# Altium schematic sheet ArcadeMVD-STM 01-1.5 complete design.SchDoc: complete design
size A3; DocumentNumber: 1; SheetNumber: 1; SheetTotal: 2; VersionControl_RevNumber: 1
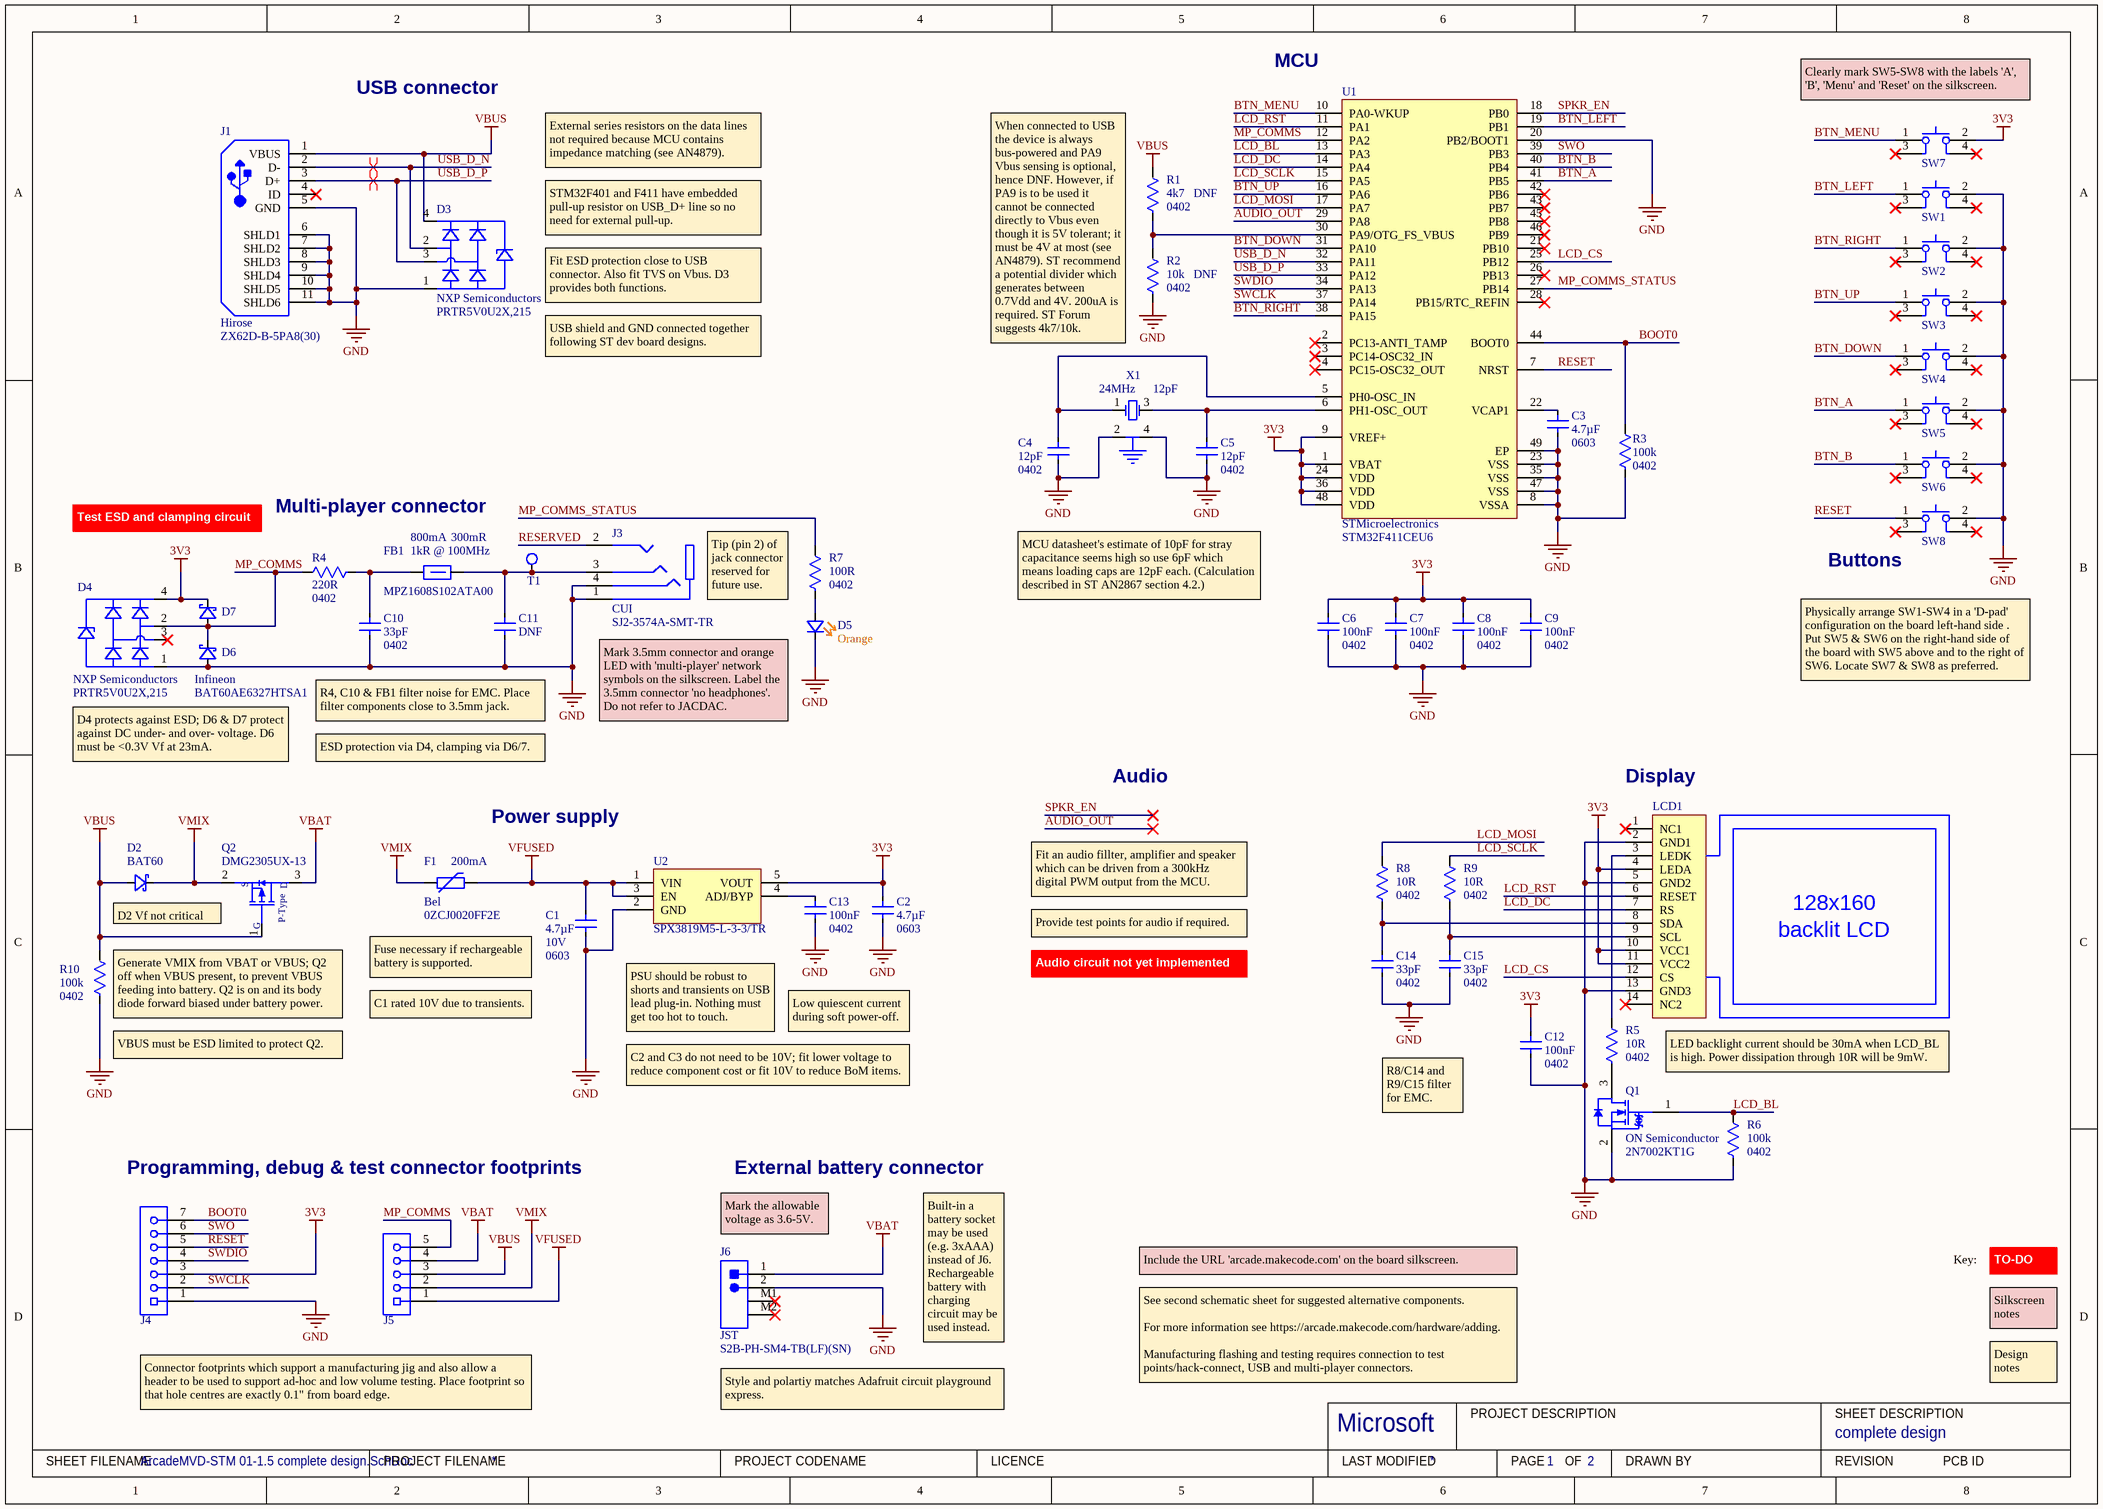
[diagram p0: ArcadeMVD-STM 01-1.5 complete design.SchDoc]

## Parts
C1  Case/Package: 0603  Capacitance: 4.7µF  Voltage Rating: 10V  [CAP 0603 (1608) x 1.2mm]  (hidden comment: CL10A475KP8NNNC)
C2  Case/Package: 0603  Capacitance: 4.7µF  [CAP 0603 (1608) x 1.2mm]  (hidden comment: CL10A475KP8NNNC)
C3  Case/Package: 0603  Capacitance: 4.7µF  [CAP 0603 (1608) x 1.2mm]  (hidden comment: CL10A475KP8NNNC)
C4  value 12pF  Package Size: 0402  [CAP0402]  (hidden comment: CAP0402_GENERIC 12pF)
C5  value 12pF  Package Size: 0402  [CAP0402]  (hidden comment: CAP0402_GENERIC 12pF)
C6  Case/Package: 0402  Capacitance: 100nF  [CAP0402]  (hidden comment: 0402YG104ZAT2A)
C7  Case/Package: 0402  Capacitance: 100nF  [CAP0402]  (hidden comment: 0402YG104ZAT2A)
C8  Case/Package: 0402  Capacitance: 100nF  [CAP0402]  (hidden comment: 0402YG104ZAT2A)
C9  Case/Package: 0402  Capacitance: 100nF  [CAP0402]  (hidden comment: 0402YG104ZAT2A)
C10  value 33pF  Package Size: 0402  [CAP0402]  (hidden comment: CAP0402_GENERIC 33pF)
C11  DNF  [CAP0402]  (no BOM)
C12  Case/Package: 0402  Capacitance: 100nF  [CAP0402]  (hidden comment: 0402YG104ZAT2A)
C13  Case/Package: 0402  Capacitance: 100nF  [CAP0402]  (hidden comment: 0402YG104ZAT2A)
C14  value 33pF  Package Size: 0402  [CAP0402]  (hidden comment: CAP0402_GENERIC 33pF)
C15  value 33pF  Package Size: 0402  [CAP0402]  (hidden comment: CAP0402_GENERIC 33pF)
D2  BAT60  [INF-SOD323_V]
D3  Manufacturer: NXP Semiconductors  Manufacturer Part Number: PRTR5V0U2X,215  [NXP-SOT143B-4_V]  (hidden comment: NXP-PRTR5V0U2X,215-4-whitesch)
D4  Manufacturer: NXP Semiconductors  Manufacturer Part Number: PRTR5V0U2X,215  [NXP-SOT143B-4_V]  (hidden comment: NXP-PRTR5V0U2X,215-4-whitesch)
D5  Colour: Orange  [Rohm SML-D12 Orange]  (hidden comment: SML-D12D)
D6  Manufacturer: Infineon  [INF-SOD323_V]  (hidden comment: BAT60AE6327HTSA1)
D7  BAT60AE6327HTSA1  [INF-SOD323_V]  (value not drawn)
F1  Manufacturer: Bel  Hold Current: 200mA  Manufacturer Part Number: 0ZCJ0020FF2E  [FUSE 1206 x 0.58mm]  (hidden comment: 0.2A/0.4A)
FB1  Manufacturer Part Number: MPZ1608S102ATA00  Impedance: 1kR @ 100MHz  DC Resistance (DCR): 300mR  Current Rating: 800mA  [TDK MPZ1608 0.8mm]  (hidden comment: TDK MPZ1608S102ATA00)
J1  Manufacturer: Hirose  Manufacturer Part Number: ZX62D-B-5PA8(30)  [HIRO-ZX62D-B-5PA8_V-noslots]  (hidden comment: ZX62D-B-5PA8(30)-whitesch)
J3  Manufacturer: CUI  Manufacturer Part Number: SJ2-3574A-SMT-TR  [SJ2-3574A-SMT-TR-BASIC]  (hidden comment: SJ2-3574A-SMT)
J4  DNF  [0022284070 pads only elongated]  (value not drawn)  (no BOM)
J5  MOLEX-0022284050-whitesch  [0022284050 pads only elongated]  (value not drawn)  (no BOM)
J6  Manufacturer: JST  [JST-S2B-PH-SM4-TB]  (hidden comment: S2B-PH-SM4-TB(LF)(SN))
LCD1  JD-T18003-T01  [JD-T18003-T01-BASIC]  (value not drawn)
Q1  Manufacturer: ON Semiconductor  Manufacturer Part Number: 2N7002KT1G  [ONSC-SOT-23-3-318-08_V]  (hidden comment: small signal N channel MOSFET)
Q2  Manufacturer Part Number: DMG2305UX-13  [DIODES-SOT23-3]  (hidden comment: MOSFET)
R1  DNF  value 4k7  Case: 0402  [RES0402]  (no BOM)
R2  DNF  value 10k  Case: 0402  [RES0402]  (no BOM)
R3  value 100k  Case: 0402  [RES0402]  (hidden comment: RES0402_GENERIC 100k)
R4  value 220R  Case: 0402  [RES0402]  (hidden comment: RES0402_GENERIC 220R)
R5  value 10R  Case: 0402  [RES0402]  (hidden comment: RES0402_GENERIC 10R)
R6  value 100k  Case: 0402  [RES0402]  (hidden comment: RES0402_GENERIC 100k)
R7  value 100R  Case: 0402  [RES0402]  (hidden comment: RES0402_GENERIC 100R)
R8  value 10R  Case: 0402  [RES0402]  (hidden comment: RES0402_GENERIC 10R)
R9  value 10R  Case: 0402  [RES0402]  (hidden comment: RES0402_GENERIC 10R)
R10  value 100k  Case: 0402  [RES0402]  (hidden comment: RES0402_GENERIC 100k)
SW1  Tact Wurth 430152050826  [Wurth 430152050836-WIDE]  (value not drawn)
SW2  Tact Wurth 430152050826  [Wurth 430152050836-WIDE]  (value not drawn)
SW3  Tact Wurth 430152050826  [Wurth 430152050836-WIDE]  (value not drawn)
SW4  Tact Wurth 430152050826  [Wurth 430152050836-WIDE]  (value not drawn)
SW5  Tact Wurth 430152050826  [Wurth 430152050836-WIDE]  (value not drawn)
SW6  Tact Wurth 430152050826  [Wurth 430152050836-WIDE]  (value not drawn)
SW7  Tact Wurth 430152050826  [Wurth 430152050836-WIDE]  (value not drawn)
SW8  Tact Wurth 430152050826  [Wurth 430152050836-WIDE]  (value not drawn)
T1  TestPoint  [Pad1.27mm]  (value not drawn)  (no BOM)
U1  Manufacturer: STMicroelectronics  Manufacturer Part Number: STM32F411CEU6  [ST UFQFPN48 SEH]  (hidden comment: ST STM32F411CEU6)
U2  Manufacturer Part Number: SPX3819M5-L-3-3/TR  [MaxLinear-SOT95P280X145-5N]  (hidden comment: SPX3819M5-L-3-3_TR)
X1  Frequency: 24MHz  Loading capacitance: 12pF  [generic xtal 3.2x2.5]  (hidden comment: 24MHz SMD xtal 3.2x2.5mm)

## Nets
3V3: C2.2 C6.2 C7.2 C8.2 C9.2 C12.2 D4.4(VCC) D7.1(K) J4.3 LCD1.4(LEDA) LCD1.10(VCC1) LCD1.11(VCC2) SW7.2 U1.1(VBAT) U1.9(VREF+) U1.24(VDD) U1.36(VDD) U1.48(VDD) U2.5(VOUT)
GND: C1.1 C2.1 C3.1 C4.1 C5.1 C6.1 C7.1 C8.1 C9.1 C10.1 C11.1 C12.1 C13.1 C14.1 C15.1 D3.1(GND) D4.1(GND) D5.1(K) D6.2(A) J1.5(GND) J1.6(SHLD1) J1.7(SHLD2) J1.8(SHLD3) J1.9(SHLD4) J1.10(SHLD5) J1.11(SHLD6) J3.1 J3.4 J4.1 J6.2 LCD1.2(GND1) LCD1.5(GND2) LCD1.13(GND3) Q1.2(S) R2.2 R3.2 R6.2 R10.2 SW1.2 SW2.2 SW3.2 SW4.2 SW5.2 SW6.2 SW8.2 U1.8(VSSA) U1.20(PB2/BOOT1) U1.23(VSS) U1.35(VSS) U1.47(VSS) U1.49(EP) U2.2(GND) X1.2 X1.4
VBAT: J5.4 J6.1 Q2.3(D)
VBUS: D2.2(A) D3.4(VCC) J1.1(VBUS) J5.3 Q2.1(G) R1.1 R10.1
VFUSED: C1.2 F1.1 J5.1 U2.1(VIN) U2.3(EN)
VMIX: D2.1(K) F1.2 J5.2 Q2.2(S)
AUDIO_OUT: U1.29(PA8)
BOOT0: J4.7 R3.1 U1.44(BOOT0)
BTN_A: SW5.1 U1.41(PB5)
BTN_B: SW6.1 U1.40(PB4)
BTN_DOWN: SW4.1 U1.31(PA10)
BTN_LEFT: SW1.1 U1.19(PB1)
BTN_MENU: SW7.1 U1.10(PA0-WKUP)
BTN_RIGHT: SW2.1 U1.38(PA15)
BTN_UP: SW3.1 U1.16(PA6)
LCD_BL: Q1.1(G) R6.1 U1.13(PA3)
LCD_CS: LCD1.12(CS) U1.25(PB12)
LCD_DC: LCD1.7(RS) U1.14(PA4)
LCD_MOSI: R8.1 U1.17(PA7)
LCD_RST: LCD1.6(RESET) U1.11(PA1)
LCD_SCLK: R9.1 U1.15(PA5)
MP_COMMS: D4.2(I/O1) D6.1(K) D7.2(A) J5.5 R4.1 U1.12(PA2)
MP_COMMS_STATUS: R7.1 U1.27(PB14)
RESERVED: J3.2
RESET: J4.5 SW8.1 U1.7(NRST)
SPKR_EN: U1.18(PB0)
SWCLK: J4.2 U1.37(PA14)
SWDIO: J4.4 U1.34(PA13)
SWO: J4.6 U1.39(PB3)
USB_D_N: D3.2(I/O1) J1.2(D-) U1.32(PA11)
USB_D_P: D3.3(I/O2) J1.3(D+) U1.33(PA12)
NetC3_2: C3.2 U1.22(VCAP1)
NetC4_2: C4.2 U1.5(PH0-OSC_IN) X1.1
NetC5_2: C5.2 U1.6(PH1-OSC_OUT) X1.3
NetC10_2: C10.2 FB1.1 R4.2
NetC11_2: C11.2 FB1.2 J3.3 T1.1
NetC13_2: C13.2 U2.4(ADJ/BYP)
NetC14_2: C14.2 LCD1.8(SDA) R8.2
NetC15_2: C15.2 LCD1.9(SCL) R9.2
NetD5_2: D5.2(A) R7.2
NetLCD1_3: LCD1.3(LEDK) R5.1
NetQ1_3: Q1.3(D) R5.2
NetR1_2: R1.2 R2.1 U1.30(PA9/OTG_FS_VBUS)

Not connected (* = marked no-connect by the designer): D4 3(I/O2)*; J1 4(ID)*; J6 M1* M2*; LCD1 1(NC1)* 14(NC2)*; SW1 3* 4*; SW2 3* 4*; SW3 3* 4*; SW4 3* 4*; SW5 3* 4*; SW6 3* 4*; SW7 3* 4*; SW8 3* 4*; U1 2(PC13-ANTI_TAMP)* 3(PC14-OSC32_IN)* 4(PC15-OSC32_OUT)* 21(PB10)* 26(PB13)* 28(PB15/RTC_REFIN)* 42(PB6)* 43(PB7)* 45(PB8)* 46(PB9)*

## Layout directives
differential pair: USB_D_N, USB_D_P

## Notes on the sheet
- USB connector
- MCU
- (near SW7) Clearly mark SW5-SW8 with the labels 'A', 'B', 'Menu' and 'Reset' on the silkscreen.
- External series resistors on the data lines not required because MCU contains impedance matching (see AN4879).
- STM32F401 and F411 have embedded pull-up resistor on USB_D+ line so no need for external pull-up.
- Fit ESD protection close to USB connector. Also fit TVS on Vbus. D3 provides both functions.
- USB shield and GND connected together following ST dev board designs.
- When connected to USB the device is always bus-powered and PA9 Vbus sensing is optional, hence DNF. However, if PA9 is to be used it cannot be connected directly to Vbus even though it is 5V tolerant; it must be 4V at most (see AN4879). ST recommend a potential divider which generates between 0.7Vdd and 4V. 200uA is required. ST Forum suggests 4k7/10k.
- Multi-player connector
- Test ESD and clamping circuit
- (near SW8) Buttons
- Tip (pin 2) of jack connector reserved for future use.
- MCU datasheet's estimate of 10pF for stray capacitance seems high so use 6pF which means loading caps are 12pF each. (Calculation described in ST AN2867 section 4.2.)
- R4, C10 & FB1 filter noise for EMC. Place filter components close to 3.5mm jack.
- Mark 3.5mm connector and orange LED with 'multi-player' network symbols on the silkscreen. Label the 3.5mm connector 'no headphones'. Do not refer to JACDAC.
- Physically arrange SW1-SW4 in a 'D-pad' configuration on the board left-hand side . Put SW5 & SW6 on the right-hand side of the board with SW5 above and to the right of SW6. Locate SW7 & SW8 as preferred.
- D4 protects against ESD; D6 & D7 protect against DC under- and over- voltage. D6 must be <0.3V Vf at 23mA.
- ESD protection via D4, clamping via D6/7.
- Audio
- (near LCD1) Display
- Power supply
- D2 Vf not critical
- Fit an audio fillter, amplifier and speaker which can be driven from a 300kHz digital PWM output from the MCU.
- Fuse necessary if rechargeable battery is supported.
- Provide test points for audio if required.
- Audio circuit not yet implemented
- (near R10) VBUS must be ESD limited to protect Q2.
- (near R10) Generate VMIX from VBAT or VBUS; Q2 off when VBUS present, to prevent VBUS feeding into battery. Q2 is on and its body diode forward biased under battery power.
- C1 rated 10V due to transients.
- PSU should be robust to shorts and transients on USB lead plug-in. Nothing must get too hot to touch.
- Low quiescent current during soft power-off.
- C2 and C3 do not need to be 10V; fit lower voltage to reduce component cost or fit 10V to reduce BoM items.
- R8/C14 and R9/C15 filter for EMC.
- LED backlight current should be 30mA when LCD_BL is high. Power dissipation through 10R will be 9mW.
- (near J4) Programming, debug & test connector footprints
- External battery connector
- (near J6) Mark the allowable voltage as 3.6-5V.
- Include the URL 'arcade.makecode.com' on the board silkscreen.
- Key:
- Silkscreen notes
- TO-DO
- Built-in a battery socket may be used (e.g. 3xAAA) instead of J6. Rechargeable battery with charging circuit may be used instead.
- See second schematic sheet for suggested alternative components.
  For more information see https://arcade.makecode.com/hardware/adding.
  Manufacturing flashing and testing requires connection to test points/hack-connect, USB and multi-player connectors.
- Design notes
- Connector footprints which support a manufacturing jig and also allow a header to be used to support ad-hoc and low volume testing. Place footprint so that hole centres are exactly 0.1" from board edge.
- Style and polartiy matches Adafruit circuit playground express.
- Microsoft
- PROJECT DESCRIPTION
- SHEET DESCRIPTION
- SHEET FILENAME
- PROJECT FILENAME
- PROJECT CODENAME
- LICENCE
- LAST MODIFIED
- PAGE
- OF
- DRAWN BY
- REVISION
- PCB ID
- (in symbol DMG2305UX-whitesch) P-Type
- (in symbol JD-T18003-T01) 128x160; backlit LCD

## Library data of the parts
C1-C3 = 4.7uF 10V X5R ±10% Samsung CL: Generic 4.7uF 10V 0603 cap, e.g. Samsung CL10A475KP8NNNC; Dielectric: X5R; Tolerance: 10%; Created By: shodges; Supplier 1: Digi-Key; Manufacturer: Samsung; Manufacturer Part Number: CL10A475KP8NNNC; Stock 1: 40000; Pricing 1: 1=0.15, 10=0.109, 100=0.0513, 500=0.036, 1000=0.0298 (USD); Mount: Surface Mount; Case Code (Imperial): 0603; Contact Plating: Tin; Min Operating Temperature: -55°C; Max Operating Temperature: 85°C; Package Quantity: 1; Packaging: Tape and Reel; Length: 1.6mm; Height: 0.8mm; Width: 0.031inch; Thickness: 0.035inch; Depth: 0.8mm; Radiation Hardening: No; Supplier Part Number 1: 1276-1044-1-ND; Supplier 2: Farnell; Supplier Part Number 2: 3010071; Case Code (Metric): 1608
  C2 C3: Voltage Rating: 10V
C4 C5 = CAP0402_GENERIC: Generic 0402 Chip Capacitor 12pF; Rated Voltage: * V
C6-C9 C12 C13 = 0402YG104ZAT2A: Generic 100nF 16V 0402 cap e.g. Kyocera/AVX 0402YG104ZAT2A; Manufacturer: Kyocera AVX; Tolerance: 80%; Dielectric: Y5V; Insulation Resistance: 100GR; Dissipation Factor: 9%; Supplier 1: Digi-Key; Manufacturer Part Number: 0402YG104ZAT2A; Stock 1: 0; Pricing 1: 1=0.1, 10=0.041, 100=0.0183, 500=0.01306, 1000=0.01026, 2500=0.00933, 5000=0.00858 (USD); Mount: Surface Mount,PCB; Case Code (Metric): 1005; Case Code (Imperial): 0402; Contact Plating: Tin,Matte; Min Operating Temperature: -30°C; Max Operating Temperature: 85°C; Packaging: Tape and Reel; Voltage Rating (DC): 16V; Termination: SMD/SMT; Voltage: 16V; Package Quantity: 1; Voltage Rating: 16V; Length: 1mm; Height: 0.5mm; Depth: 0.5mm; Width: 0.02inch; Thickness: 0.022inch; Radiation Hardening: No; REACH SVHC: No SVHC; Lead Free: Lead Free; ComponentLink2URL: http://datasheets.avx.com/Y5V.pdf; ComponentLink2Description: AVX datasheet online; Supplier 2: Farnell; Supplier 3: Mouser; Supplier 4: RSComponents; Supplier Part Number 1: 478-1138-1-ND; Supplier Part Number 2: 1327667; Supplier Part Number 3: 581-040216G104Z; Supplier Part Number 4: 698-3190
C10 C14 C15 = CAP0402_GENERIC: Generic 0402 Chip Capacitor 33pF; Rated Voltage: * V
C11 = CAP0402_GENERIC: Generic 0402 Chip Capacitor; Rated Voltage: * V; Value: 33pF; Package Size: 0402
D2 D7 = BAT60AE6327HTSA1: Schottky diode, 3A low Vf; Manufacturer: Infineon; Max Repetitive Reverse Voltage (Vrrm): 10V; Element Configuration: Single; Peak Non-Repetitive Surge Current: 5A; Forward Voltage: 370mV; Polarity: Standard; Stock 1: 55772; Pricing 1: 1=0.47, 10=0.354, 100=0.2204, 500=0.15078, 1000=0.11598 (USD); Mount: Surface Mount; Case/Package: SOD-323-2; Number of Pins: 2; Contact Plating: Tin; Min Operating Temperature: -55°C; Max Operating Temperature: 85°C; Average Rectified Current: 3A; Packaging: Tape and Reel; Forward Current: 3A; Max Reverse Voltage (DC): 10V; Voltage Rating (DC): 10V; Current Rating: 3A; Output Current: 3A; Radiation Hardening: No; REACH SVHC: No SVHC; Lead Free: Lead Free; Halogen Free: Not Halogen Free; ComponentLink1URL: http://www.infineon.com/dgdl/bat60aseries.pdf?folderId=db3a304313d846880113def5812204a1&fileId=db3a304313d846880113def70c9304a9&src-supplier=Avnet; ComponentLink1Description: Infineon datasheet online; Supplier 2: Farnell; Supplier 3: Mouser; Supplier 4: RSComponents; Supplier 1: Digi-Key; Supplier Part Number 1: BAT60AE6327HTSA1CT-ND; Supplier Part Number 2: 2432679; Supplier Part Number 3: 726-BAT60AE6327HTSA1; Supplier Part Number 4: 7527855; Manufacturer Part Number: BAT60AE6327HTSA1; ComponentLink3Description: Infineon datasheet; ComponentLink3URL: y:\System\Altium\Libraries 2014\Infineon\Datasheets\Infineon-BAT60ASERIES-DS-v01_01-en.pdf
D3 D4 = NXP-PRTR5V0U2X,215-4-whitesch: USB TVS and ESD protection diodes; Capacitance: 16pF; Breakdown Voltage: 6V; Direction: Unidirectional; Number of Channels: 2; Number of Elements: 1; Polarity: Bidirectional,Unidirectional; Working Voltage: 5.5V; Power Line Protection: Yes; Leakage Current: 100nA; Max Breakdown Voltage: 9V; Max Reverse Leakage Current: 100uA; Supplier 1: Digi-Key; Stock 1: 109808; Pricing 1: 1=0.55, 10=0.47, 100=0.3507, 500=0.27552, 1000=0.2129 (USD); Mount: Surface Mount; Case/Package: SOT; Number of Pins: 4; Weight: 0.001lb; Contact Plating: Tin; Min Operating Temperature: -40°C; Max Operating Temperature: 85°C; Packaging: Tape and Reel; Termination: SMD/SMT; Reverse Breakdown Voltage: 6V; Package Quantity: 1; Number of Bidirectional Channels: 2; Reverse Standoff Voltage: 5.5V; Min Breakdown Voltage: 6V; ESD Protection: Yes; Length: 3mm; Height: 1.1mm; Width: 1.4mm; Depth: 1.4mm; Radiation Hardening: No; REACH SVHC: No SVHC; Lead Free: Lead Free; ComponentLink8URL: http://www.farnell.com/datasheets/109718.pdf?src-supplier=Farnell; ComponentLink8Description: NXP datasheet; Supplier 2: Farnell; Supplier 3: RSComponents; Supplier 4: Mouser; Supplier Part Number 4: 771-PRTR5V0U2X-T/R; Supplier Part Number 3: 725-8720; Supplier Part Number 2: 2371119; Supplier Part Number 1: 1727-3884-1-ND
D5 = SML-D12D: Generic 0603 Orange LED, e.g. Rohm SML-D12D8WT86; Manufacturer: Rohm Semiconductor; Wavelength - Dominant: 605nm; Millicandela Rating: 100mcd; Voltage - Forward (Vf) (Typ): 2.2V; Current - Test: 20mA; Lens Type: Diffused, White; Lens Style/Size: Rectangle with Flat Top, 1.2mm x 0.8mm; Supplier 1: Digi-Key; Manufacturer Part Number: SML-D12D8WT86; RoHS: RoHS Compliant; Category: Optoelectronics; Stock 1: 1719; Pricing 1: 1=0.38, 10=0.279, 25=0.2232, 100=0.1478, 250=0.1046, 500=0.08926, 1000=0.06974 (GBP); Packaging: Cut Tape (CT); Wavelength - Peak: -; Viewing Angle: -; Package / Case: 0603 (1608 Metric); Size / Dimension: 1.60mm L x 0.80mm W; Height: 0.55mm; Mounting Type: Surface Mount; Luminous Flux @ Current - Test: -; ComponentLink1URL: http://rohmfs.rohm.com/en/products/databook/datasheet/opto/led/chip_mono/sml-d1.pdf; ComponentLink1Description: http://rohmfs.rohm.com/en/products/databook/datasheet/opto/led/chip_mono/sml-d1.pdf; Supplier Part Number 1: 511-1577-1-ND
D6 = BAT60AE6327HTSA1: Schottky diode, 3A low Vf; Max Repetitive Reverse Voltage (Vrrm): 10V; Element Configuration: Single; Peak Non-Repetitive Surge Current: 5A; Forward Voltage: 370mV; Polarity: Standard; Stock 1: 55772; Pricing 1: 1=0.47, 10=0.354, 100=0.2204, 500=0.15078, 1000=0.11598 (USD); Mount: Surface Mount; Case/Package: SOD-323-2; Number of Pins: 2; Contact Plating: Tin; Min Operating Temperature: -55°C; Max Operating Temperature: 85°C; Average Rectified Current: 3A; Packaging: Tape and Reel; Forward Current: 3A; Max Reverse Voltage (DC): 10V; Voltage Rating (DC): 10V; Current Rating: 3A; Output Current: 3A; Radiation Hardening: No; REACH SVHC: No SVHC; Lead Free: Lead Free; Halogen Free: Not Halogen Free; ComponentLink1URL: http://www.infineon.com/dgdl/bat60aseries.pdf?folderId=db3a304313d846880113def5812204a1&fileId=db3a304313d846880113def70c9304a9&src-supplier=Avnet; ComponentLink1Description: Infineon datasheet online; Supplier 2: Farnell; Supplier 3: Mouser; Supplier 4: RSComponents; Supplier 1: Digi-Key; Supplier Part Number 1: BAT60AE6327HTSA1CT-ND; Supplier Part Number 2: 2432679; Supplier Part Number 3: 726-BAT60AE6327HTSA1; Supplier Part Number 4: 7527855; Manufacturer Part Number: BAT60AE6327HTSA1; ComponentLink3Description: Infineon datasheet; ComponentLink3URL: y:\System\Altium\Libraries 2014\Infineon\Datasheets\Infineon-BAT60ASERIES-DS-v01_01-en.pdf
F1 = PTC Bel Fuse 0ZCJ0020FF2E: Generic 1206 resetable fuse 0.2A hold 0.4A trip e.g. Bel Fuse 0ZCJ0020FF2E; Max Current Rating: 10A; Max Voltage Rating (DC): 30V; Power Dissipation: 400mW; Trip Current: 400mA; Time to Trip: 0.1s; Approvals: UL,TUV; ComponentLink1Description: Bel fuse datasheet; ComponentLink1URL: y:\System\Altium\Libraries 2014\Bel\Datasheets\0ZCJ+Nov2016; ComponentLink2Description: Bel fuse datasheet online; ComponentLink2URL: https://www.belfuse.com/resources/CircuitProtection/datasheets/0ZCJ%20Nov2016.pdf; Supplier 1: Digi-Key; Stock 1: 286959; Pricing 1: 1=0.13, 5=0.13, 10=0.125, 50=0.1114, 100=0.1037, 250=0.09216, 500=0.0768, 1000=0.07296 (USD); Mount: Surface Mount; Case/Package: 1206; Case Code (Metric): 3216; Case Code (Imperial): 1206; Contact Plating: Tin,Matte; Number of Terminals: 2; Min Operating Temperature: -40°C; Max Operating Temperature: 85°C; Package Quantity: 3000; Packaging: Cut Tape; Lead Free: Lead Free; Supplier 2: Farnell; Supplier 3: Mouser; Supplier Part Number 3: 530-0ZCJ0020FF2E; Supplier Part Number 2: 2848524; Supplier Part Number 1: 507-1797-1-ND
FB1 = TDK MPZ1608S102ATA00: 0603 1k@100MHz 0.8A chip; Tolerance: 25%; Core Material: Ferrite; Supplier 1: Digi-Key; Stock 1: 113542; Pricing 1: 1=0.1, 10=0.079, 25=0.0716, 50=0.0644, 100=0.0472, 250=0.03432, 500=0.03146, 1000=0.02717 (USD); Mount: Surface Mount; Case/Package: 0603; Case Code (Metric): 1608; Case Code (Imperial): 0603; Package Quantity: 4000; Packaging: Tape and Reel; Length: 0.063inch; Height: 0.037inch; Width: 0.031inch; Supplier 2: Mouser; Supplier Part Number 1: 445-8694-1-ND; Supplier Part Number 2: 810-MPZ1608S102ATA00; ComponentLink2Description: datasheet online; ComponentLink2URL: https://www.mouser.co.uk/datasheet/2/400/eads_commercial_power_mpz1608_en-923650.pdf; Manufacturer: TDK; Max DC Current: 800mA; ComponentLink3Description: datasheet; ComponentLink3URL: Y:\System\Altium\Libraries 2014\TDK\Datasheets\eads_commercial_power_mpz1608_en-923650.pdf
J1 = ZX62D-B-5PA8(30)-whitesch: Micro USB SMD with TH mechanical mount; Number of Contacts: 5; Gender: Receptacle; USB Standard: USB 2.0; Supplier 1: Digi-Key; Stock 1: 12999; Pricing 1: 1=0.77, 10=0.726, 25=0.6536, 50=0.5808, 100=0.5566, 250=0.5082, 500=0.484, 1000=0.3993 (USD); Mount: Surface Mount,Horizontal; Number of Pins: 5; Contact Material: Copper Alloy; Contact Plating: Gold; Packaging: Tape and Reel; Connector Type: USB; Orientation: Right Angle; REACH SVHC: Unknown; Lead Free: Lead Free; Supplier 2: Farnell; Supplier 3: Mouser; Supplier 4: RSComponents; Supplier Part Number 1: H125718CT-ND; Supplier Part Number 2: 2554981; Supplier Part Number 3: 798-ZX62D-B-5PA830; Supplier Part Number 4: 1360893; ComponentLink1Description: datasheet; ComponentLink1URL: Y:\System\Altium\Libraries 2014\Hirose\Datasheets\Hirose-ZX.pdf
J3 = SJ2-3574A-SMT: Generic 3/4-way 3.5mm jack socket SMD R/A, e.g. CUI SJ2-3574A-SMT; Number of Conductors: 4; Number of Ports: 1; Shielding: Unshielded; Supplier 1: Digi-Key; Stock 1: 2113; Pricing 1: 1=1.15, 10=1.013, 25=0.9532, 50=0.9134, 100=0.8736, 250=0.7942, 500=0.71478 (USD); Color: Black; Connector Type: Jack; Orientation: Horizontal; Supplier 2: Mouser; Supplier Part Number 1: CP-SJ2-3574A-SMT-CT-ND; Supplier Part Number 2: 490-SJ2-3574A-SMT-TR; ComponentLink1Description: CUI datasheet; ComponentLink1URL: https://www.cui.com/product/resource/sj2-357x-smt.pdf
J4 = MOLEX-0022284070-whitesch: CONN HEADER 7POS .100 VERT TIN; Manufacturer: Molex; Contact Resistance: 20mR; Number of Positions: 7; Gender: Male; Connector Type: Male Pin; Max Voltage Rating (AC): 250V; Pitch: 2.54mm; ComponentLink1URL: http://www.molex.com/pdm_docs/sd/022284060_sd.pdf; ComponentLink1Description: technical drawing; Supplier 1: Digi-Key; Manufacturer Part Number: 0022284070; Stock 1: 0; Mount: Through Hole; Color: Black; Contact Plating: Tin; Contact Material: Bronze; Housing Color: Black; Housing Material: Nylon; Min Operating Temperature: 0°C; Max Operating Temperature: 75°C; Package Quantity: 1; Packaging: Bulk; Number of Rows: 1; Termination: Solder; Number of Contacts: 7; Orientation: Straight; Length: 17.78mm; Contact Mating Length: 0.24inch; Depth: 2.49mm; Supplier Part Number 1: WM50014-07-ND
J5 = MOLEX-0022284050-whitesch: CONN HEADER 5POS .100 VERT TIN; Manufacturer: Molex, LLC; Connector Type: Header, Unshrouded, Breakaway; Number of Positions: 5; Number of Positions Loaded: All; Pitch: 0.100" (2.54mm); RoHS: RoHS Compliant; Category: Connectors, Interconnects; Packaging: Bulk; Contact Type: Male Pin; Number of Rows: 1; Row Spacing: -; Contact Mating Length: 0.240" (6.10mm); Mounting Type: Through Hole; Termination: Solder; Fastening Type: -; Features: -; Contact Finish: Tin; Contact Finish Thickness: 100µin (2.54µm); Color: Black; ComponentLink1URL: http://www.molex.com/pdm_docs/sd/022284050_sd.pdf; ComponentLink1Description: molex drawing online; Supplier 1: Digi-Key; Supplier 2: Farnell; Supplier Part Number 1: WM50014-05-ND; Supplier Part Number 2: 2381173; Manufacturer Part Number: 0022284050
J6 = S2B-PH-SM4-TB(LF)(SN): Generic male header, pitch 2 mm, 1x2 position, e.g. JST S2B-PH-SM4-TB(LF)(SN); Current Rating: 2A; Voltage Rating: 100V; Number of Poles: 2; Insulation Resistance: 1GR; Contact Resistance: 20mR; Connector Type: Male Pin; Pitch: 2mm; Min Operating Temperature: -25°C; Width: 5mm; ComponentLink1Description: JST connector selector website; ComponentLink2Description: JST datasheet; ComponentLink1URL: http://www.jst.com/home2.html; Contact Plating: Tin,Copper; ComponentLink2URL: http://www.jst-mfg.com/product/pdf/eng/ePH.pdf; Mount: Surface Mount; Length: 7.9mm; Lead Pitch: 2mm; Max Operating Temperature: 85°C; Height: 9.4mm; Packaging: Tape and Reel; Contact Material: Copper Alloy,Bronze,Tin,Brass; Supplier 1: Digi-Key; Stock 1: 179134; Pricing 1: 1=0.58, 10=0.547, 100=0.4194, 500=0.3647 (USD); Color: Natural,White; Housing Color: Beige; Housing Material: Polyamide; Number of Rows: 1; Number of Positions: 2; Termination: Solder; Orientation: Right Angle; Gender: Male; Voltage Rating (AC): 100V; Max Current Rating: 2A; Fastening Type: Detent; Number of Contacts: 2; Working Voltage: 100V; Max Voltage Rating (AC): 100V; Max Voltage Rating (DC): 100V; Contact Mating Length: 0.13inch; Depth: 7.6mm; REACH SVHC: No SVHC; Lead Free: Lead Free; Flammability Rating: UL94 V-0; Supplier 2: Farnell; Supplier 3: RSComponents; Supplier Part Number 1: 455-1749-1-ND; Supplier Part Number 2: 9492615; Supplier Part Number 3: 688-1353; Manufacturer Part Number: S2B-PH-SM4-TB(LF)(SN)
LCD1 = JD-T18003-T01: Generic 128x160 backlit colour LCD, e.g. Truly Semi JD-T18003-T01; Manufacturer: Truly Semiconductor; Supplier 1: Digi-Key; Supplier Part Number 1: 1528-2562-ND; ComponentLink1Description: Truly Semiconductor datasheet; ComponentLink1URL: https://cdn-shop.adafruit.com/datasheets/JD-T1800.pdf; ComponentLink2Description: Adafruit product page; ComponentLink2URL: https://www.adafruit.com/product/618; Stock 1: 65; Pricing 1: 1=9.95 (USD); Supplier 2: Mouser; Supplier Part Number 2: 485-618; Manufacturer Part Number: JD-T18003-T01; Supplier 3: Adafruit; Supplier Part Number 3: 618
Q1 = 2N7002K: Generic N-channel small signal MOSFET, e.g. On Semi 2N7002K; Max Power Dissipation: 420mW; Continuous Drain Current (ID): 320mA; Input Capacitance: 24.5pF; Power Dissipation: 300mW; Number of Elements: 1; Rds On Max: 1.6R; Drain to Source Breakdown Voltage: 60V; Threshold Voltage: 2.3V; Element Configuration: Single; Gate to Source Voltage (Vgs): 20V; Turn-Off Delay Time: 55.8ns; Turn-On Delay Time: 12.2ns; Rise Time: 9ns; Supplier 1: Digi-Key; Stock 1: 2170; Pricing 1: 1=0.21, 10=0.193, 100=0.1264, 500=0.0618, 1000=0.04214 (USD); Case/Package: SOT-23-3; Number of Pins: 3; Contact Plating: Matte,Tin; Min Operating Temperature: -55°C; Max Operating Temperature: 150°C; Packaging: Tape and Reel; Package Quantity: 1; Drain to Source Resistance: 1.6R; Nominal Vgs: 2.3V; On-State Resistance: 1.6R; Fall Time: 9ns; Length: 3.04mm; Height: 1.01mm; Width: 1.4mm; Radiation Hardening: No; Lead Free: Lead Free; REACH SVHC: No SVHC; Halogen Free: Halogen Free; Supplier 2: Farnell; ComponentLink1Description: On Semi datasheet; ComponentLink1URL: https://www.onsemi.com/pub/Collateral/2N7002K-D.pdf; Supplier Part Number 2: 1764535; Supplier Part Number 1: 2N7002KT1GOSCT-ND; Supplier 3: Mouser; Supplier 4: RSComponents; Supplier Part Number 3: 863-2N7002KT1G; Supplier Part Number 4: 780-0478
Q2 = DMG2305UX-whitesch: MOSFET P-CH 20V 4.2A SOT23; Manufacturer: Diodes; Rise Time: 13.7ns; Rds On Max: 52mR; Input Capacitance: 808pF; Max Power Dissipation: 1.4W; Turn-On Delay Time: 10.8ns; Turn-Off Delay Time: 79.3ns; Fall Time: 34.7ns; Threshold Voltage: -900mV; Element Configuration: Single; Gate to Source Voltage (Vgs): 8V; Number of Channels: 1; Drain to Source Breakdown Voltage: -20V; On-State Resistance: 65MR; Supplier 1: Digi-Key; Stock 1: 131638; Pricing 1: 1=0.44, 10=0.398, 100=0.2228, 500=0.1194, 1000=0.0812 (USD); Mount: Surface Mount; Case/Package: TO-236-3; Number of Pins: 3; Weight: 0.000282oz; Min Operating Temperature: -55°C; Max Operating Temperature: 150°C; Package Quantity: 1; Packaging: Tape and Reel; Continuous Drain Current (ID): 4.2A; Drain to Source Voltage (Vdss): 20V; Drain to Source Resistance: 52mR; Length: 3mm; Height: 1.1mm; Width: 1.4mm; Radiation Hardening: No; REACH SVHC: No SVHC; Lead Free: Lead Free; ComponentLink2URL: https://datasheet.ciiva.com/18566/dmg2305ux-18566951.pdf; ComponentLink2Description: online datasheet; Supplier Part Number 1: DMG2305UX-13DICT-ND; ComponentLink3Description: datasheet; ComponentLink3URL: Y:\System\Altium\Libraries 2014\Diodes Inc\Datasheets\dmg2305ux-30023840.pdf; Supplier 2: Farnell; Supplier 3: Mouser; Supplier 4: RSComponents; Supplier Part Number 2: 2543533; Supplier Part Number 3: 621-DMG2305UX-7; Supplier Part Number 4: 8270452
R1 = RES0402_GENERIC: Generic 0402 Chip Resistor 4k7
R2 = RES0402_GENERIC: Generic 0402 Chip Resistor 10k
R3 R6 R10 = RES0402_GENERIC: Generic 0402 Chip Resistor 100k
R4 = RES0402_GENERIC: Generic 0402 Chip Resistor 220R
R5 R8 R9 = RES0402_GENERIC: Generic 0402 Chip Resistor 10R
R7 = RES0402_GENERIC: Generic 0402 Chip Resistor 100R
SW1-SW8 = Tact Wurth 430152050826: Generic 6x6mm SPST button e,g, Wurth 430152050826; Manufacturer: Wurth Electronics; Switch Function: Off-Mom; Actuator Type: Standard; Operating Force: 260gf; Actuator Material: Polymer,Liquid Crystal Polymer; Switch Travel: 0.25mm; Mechanical Life: 200000Cycles; Contact Current Rating: 50mA; Illumination Type: Non-Illuminated,Illuminated; Actuator Length: 1.6mm; Supplier 1: Digi-Key; Stock 1: 2282; Packaging: Tape and Reel; Supplier Part Number 1: 732-6993-1-ND; Manufacturer Part Number: 430152050826; Supplier 2: Farnell; Supplier 3: RSComponents; Supplier Part Number 2: 2065110; Supplier Part Number 3: 7856213; Pricing 1: 1=0.47, 500=0.38232 (USD); Mount: Surface Mount; Contact Material: Stainless Steel,Steel; Min Operating Temperature: -40°C; Max Operating Temperature: 85°C; Current Rating: 50mA; Termination: Gull Wing; Throw Configuration: SPST; Length: 6.2mm; Height: 5mm; Width: 6.2mm; REACH SVHC: No SVHC; ComponentLink1URL: http://www.farnell.com/datasheets/1910150.pdf?src-supplier=Element14; ComponentLink1Description: wurth datasheet online; ComponentLink2Description: wurth datasheet; ComponentLink2URL: Y:\System\Altium\Libraries 2014\Wurth\Datasheets\4301x2xxx8x6 1910150.pdf
T1 = TestPoint: Test Point
U1 = ST STM32F411CEU6: ARM Cortex M4 MCU+FPU 512k Flash, 128k RAM, 100MHz, QFPN48; RAM Size: 128KB; Max Power Dissipation: 625mW; Interface: I2C,I2S,IrDA,LIN,MMC,SD,SDIO,SPI,UART,USART,USB; Number of I/Os: 36; Number of Timers/Counters: 8; Oscillator Type: Internal; Min Supply Voltage: 1.7V; Max Supply Voltage: 3.6V; Data Bus Width: 32b; Watchdog Timer: Yes; Memory Size: 512KB; Number of ADC Channels: 16; Peripherals: Brown-out Detect/Reset,DMA,POR,PWM,WDT; Operating Supply Voltage: 3.3V; ComponentLink1Description: ST datasheet; ComponentLink1URL: https://www.st.com/resource/en/datasheet/stm32f411vc.pdf; Supplier 1: Digi-Key; Stock 1: 16657; Pricing 1: 1=6.25, 10=5.65, 260=4.46708, 520=4.07294, 1040=3.54739 (USD); Mount: Surface Mount; Case/Package: UFQFPN; Number of Pins: 48; Min Operating Temperature: -40°C; Max Operating Temperature: 85°C; Packaging: Tray; Frequency: 100MHz; Number of Programmable I/O: 36; Max Frequency: 100MHz; Memory Type: FLASH; Package Quantity: 1560; Core Architecture: ARM; Length: 7mm; Width: 7mm; Radiation Hardening: No; Lead Free: Lead Free; REACH SVHC: No SVHC; Supplier 2: Farnell; Supplier 3: Mouser; Supplier 4: RSComponents; Supplier Part Number 1: 497-14907-ND; Supplier Part Number 2: 2456965; Supplier Part Number 3: 511-STM32F411CEU6; Supplier Part Number 4: 1106616
U2 = SPX3819M5-L-3-3_TR: 3.3V LDO; Manufacturer: Exar; Dropout Voltage: 340mV; Number of Outputs: 1; Min Input Voltage: 2.5V; Output Current: 500mA; Max Input Voltage: 16V; Polarity: Positive; Quiescent Current: 3uA; Accuracy: 1%; Output Type: Fixed; Supplier 1: Digi-Key; Stock 1: 72378; Pricing 1: 1=0.57, 10=0.479, 25=0.4196, 100=0.3595, 250=0.3116, 500=0.26364, 1000=0.20373 (USD); Mount: Surface Mount; Case/Package: SOT-23-5; Number of Pins: 5; Min Operating Temperature: -40°C; Max Operating Temperature: 125°C; Output Voltage: 3.3V; Packaging: Tape and Reel; Max Output Current: 500mA; Number of Regulators: 1; Min Output Voltage: 3.3V; Output Voltage Accuracy: 1%; Length: 2.9mm; Height: 1.3mm; Width: 1.6mm; Radiation Hardening: No; Lead Free: Lead Free; Supplier 2: Farnell; Supplier 3: Mouser; Supplier 4: RSComponents; Supplier Part Number 1: 1016-1873-1-ND; Supplier Part Number 2: 2889625; Supplier Part Number 3: 701-SPX3819M5-L-33TR; Supplier Part Number 4: 8472888; ComponentLink3Description: MaxLinear datasheet online; ComponentLink3URL: https://www.maxlinear.com/ds/spx3819.pdf; ComponentLink4Description: Maxlinear datasheet; ComponentLink4URL: Y:\System\Altium\Libraries 2014\MaxLinear (was Exar)\datasheets\SPX3819.pdf
X1 = 24MHz SMD xtal 3.2x2.5mm: Generic 3.2x2.5mm 24MHz 12pF SMD xtal, e.g. Multicomp MCSJK-7U-24.00-12-10-60-B-10; Tolerance: ±10ppm; ESR: 60R; Stability: *; Footprint: SMD 3225; Manufacturer Part Number: MCSJK-7U-24.00-12-10-60-B-10; Supplier 1: Farnell; Manufacturer: Multicomp; Stock 1: 2335; Pricing 1: 5=0.14, 50=0.114, 250=0.105, 500=0.099, 1500=0.095, 3000=0.086, 15000=0.0843 (GBP); Supplier Part Number 1: 2853960; ComponentLink1Description: online datasheet; ComponentLink1URL: http://www.farnell.com/datasheets/2645227.pdf?_ga=2.202843601.1706070776.1558802095-240913015.1522930266; ComponentLink2Description: datasheet; ComponentLink2URL: Y:\System\Altium\Libraries 2014\Multicomp\datasheets\MCSJK-7U 3.2x2.5mm SMD xtals.pdf